# Altium schematic sheet PLL.SchDoc
size A4; SheetNumber: 15; SheetTotal: 15
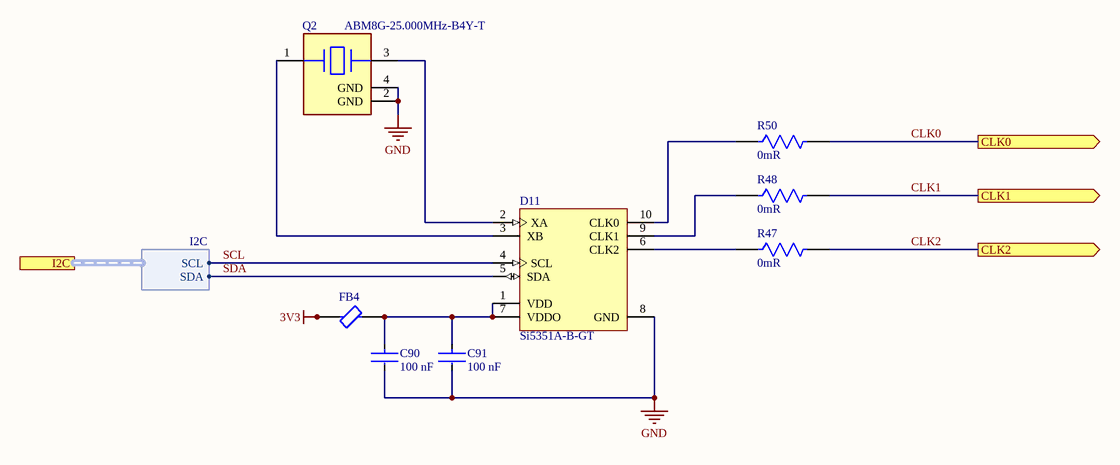
[diagram p0: PLL.SchDoc]

## Parts
C90  Capacitance: 100 nF  [FP-CC0805-0_85-IPC_A]  (hidden comment: CC0805KRX7R9BB104)
C91  Capacitance: 100 nF  [FP-CC0805-0_85-IPC_A]  (hidden comment: CC0805KRX7R9BB104)
D11  Si5351A-B-GT  [SLAB-MSOP-10_L]
FB4  BLM21AG601SN1J  [FP-BLM21-0_2-t0_85-e0_5-IPC_A]  (value not drawn)
Q2  ABM8G-25.000MHz-B4Y-T  [FP-ABM8G-MFG]
R47  Resistance: 0mR  [FP-CR0805-IPC_A]  (hidden comment: CR0805-J/-000ELF)
R48  Resistance: 0mR  [FP-CR0805-IPC_A]  (hidden comment: CR0805-J/-000ELF)
R50  Resistance: 0mR  [FP-CR0805-IPC_A]  (hidden comment: CR0805-J/-000ELF)

## Ports
CLK0 (out), CLK1 (out), CLK2 (out), I2C (harness I2C)

## Harnesses
I2C: SDA, SCL

## Nets
3V3: FB4.1
GND: C90.2 C91.2 D11.8(GND) Q2.2(GND) Q2.4(GND)
CLK0: R50.2 ; port CLK0
CLK1: R48.2 ; port CLK1
CLK2: R47.2 ; port CLK2
SCL: D11.4(SCL) ; port I2C.SCL
SDA: D11.5(SDA) ; port I2C.SDA
NetC90_1: C90.1 C91.1 D11.1(VDD) D11.7(VDDO) FB4.2
NetD11_2: D11.2(XA) Q2.3
NetD11_3: D11.3(XB) Q2.1
NetD11_6: D11.6(CLK2) R47.1
NetD11_9: D11.9(CLK1) R48.1
NetD11_10: D11.10(CLK0) R50.1

## Library data of the parts
C90 C91 = CMP-2100-03606-3: CAP CER 0.1UF 50V X7R 0805; Manufacturer: Yageo; Value: 100 nF; Category: Cap; Manufacturer Part Number: CC0805KRX7R9BB104; Case/Package: 0805
D11 = CMP-0510-00012-1: I2C-Programmable Any-Frequency CMOS Clock Generator + VCXO, 2.5 / 3.3 V, 0.008 to 160 MHz Output, -40 to 85 degC, 10-pin SOP; Manufacturer: Silicon Labs; PackageDescription: 10-Pin Mini Small Outline Package, Body 3 x 3 mm, Pitch 0.5 mm; PartNumber: Si5351A-B-GT; Manufacturer Part Number: SI5351A-B-GT; value: SI5351A-B-GT; Case/Package: MSOP-10; Category: IC
FB4 = CMP-0686-00643-3: Chip Ferrite Bead, 0805, 600Ω @ 100MHz, 0.2Ω, 25%, 700mA; Manufacturer: Murata; Number of Pins: 2; Case/Package: 0805; Termination: Flat; Manufacturer Part Number: BLM21AG601SN1J; value: BLM21AG601SN1J; Category: Inductor
Q2 = CMP-27762-000021-1: CRYSTAL 25.0000MHZ 10PF SMD; Manufacturer: Abracon; Termination: SMD/SMT; Case/Package: SMD/SMT; Number of Pins: 4; Manufacturer Part Number: ABM8G-25.000MHZ-B4Y-T; value: ABM8G-25.000MHZ-B4Y-T; Category: CrystalsandOscillators
R47 R48 R50 = CMP-07231-004348-1: Thick Film Chip Resistors 0805 0Ω 0.125W 5%; Manufacturer: Bourns; Case/Package: 0805; Number of Pins: 2; Termination: SMD/SMT; Manufacturer Part Number: CR0805-J/-000ELF; value: 0Ω; Category: Res